# EAGLE design Lightning Breakout (EAGLE 7.2.0)
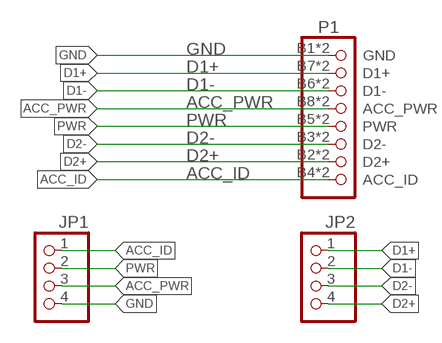
[diagram p0: schematic, sheet 1]

## Parts
JP1  PINHD-1X4  [1X04]
JP2  PINHD-1X4  [1X04]
P1  LIGHTNING-8PIN  [LIGHTNING]

## Nets
ACC_ID: JP1.1 P1.B4(ACC_ID) P1.T8(ACC_ID)
ACC_PWR: JP1.3 P1.B8(ACC_PWR) P1.T4(ACC_PWR)
D1+: JP2.1 P1.B7(D1+) P1.T2(D1+)
D1-: JP2.2 P1.B6(D1-) P1.T3(D1-)
D2+: JP2.4 P1.B2(D2+) P1.T7(D2+)
D2-: JP2.3 P1.B3(D2-) P1.T6(D2-)
GND: JP1.4 P1.B1(GND) P1.T1(GND)
PWR: JP1.2 P1.B5(PWR) P1.T5(PWR)

## Library data of the parts
JP1 JP2 = pinhead:PINHD-1X4: PIN HEADER
P1 = Apple_Lightning:LIGHTNING: PIN HEADER

## Board
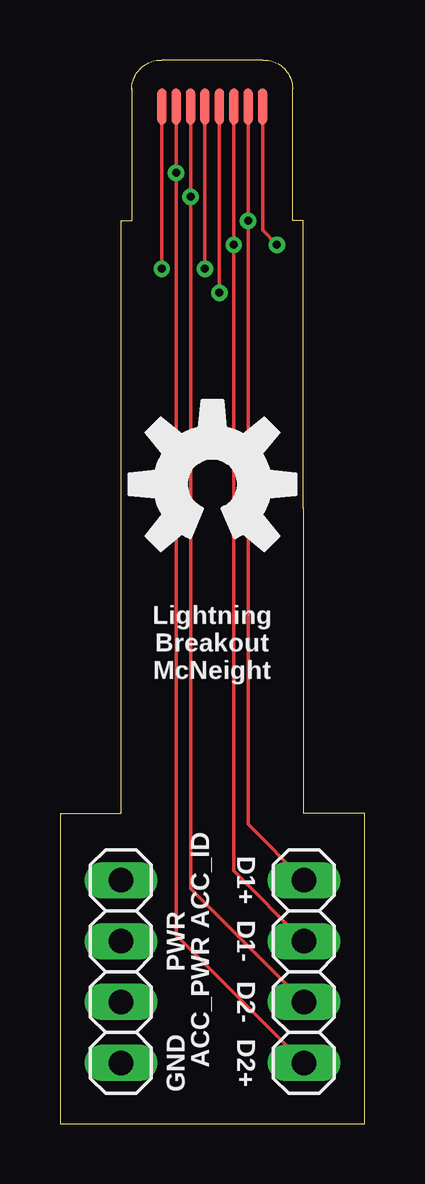
[diagram p1: board, top side]
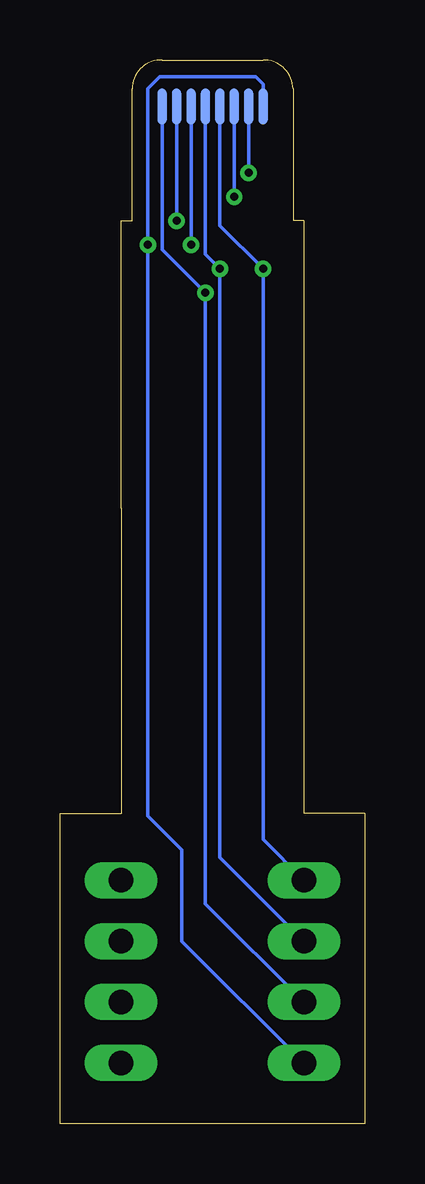
[diagram p2: board, bottom side, seen from below]

Size 12.7 x 44.35 mm. Coordinates in mm from the lower left corner, seen from the top.
Outline: 10.14,25.65 10.14,12.95 12.7,12.95 12.7,0 0,0 0,12.95 2.54,12.95 2.54,25.65
Copper layers (1*16): Top 0.0356mm / dielectric 1.5011mm / Bottom 0.0356mm
Design rules "oshpark-2layer": minimum track width 6mil, minimum drill 13mil, track to track 6mil, track to pad 6mil, pad to pad 6mil, via to via 6mil, smd to smd 6mil, copper to edge 15mil, drill to drill 6mil, minimum pad ring 7mil, minimum via ring 7mil, stop-mask expansion 4mil, vias tented up to drill 0mil, thermal gap 10mil

### Footprints (pad centres in the part's own frame; a part is rotated, then mirrored left to right if it is on the bottom)
1X04 = drill 1.016 long: 1 -3.81,0; 2 -1.27,0; 3 1.27,0; 4 3.81,0
LIGHTNING = smd 0.38 x 1.51 bottom: B1 -2.1,4.755; B2 -1.5,4.755; B3 -0.9,4.755; B4 -0.3,4.755; B5 0.3,4.755; B6 0.9,4.755; B7 1.5,4.755; B8 2.1,4.755 | smd 0.38 x 1.51: T1 2.1,4.755; T2 1.5,4.755; T3 0.9,4.755; T4 0.3,4.755; T5 -0.3,4.755; T6 -0.9,4.755; T7 -1.5,4.755; T8 -2.1,4.755

### Placement (x,y rotation side)
JP1  2.54,6.35 270 top
JP2  10.16,6.35 270 top
P1  6.34,37.65 0 top
U$1  [OSHW-LOGO-L]  6.35,26.67 0 top

### Tracks (layer width: path | path; a pad name or v marks a point on that pad's centre or on a via)
ACC_ID  (via drill 0.33 pad 0.41)
  Top 0.152: P1.T8 v4.24,35.65
  Bottom 0.152: P1.B4 6.04,37.45 v4.24,35.65 4.24,11.86 JP1.1
ACC_PWR  (via drill 0.33 pad 0.41)
  Top 0.152: P1.T4 v6.64,34.65
  Bottom 0.152: P1.B8 8.44,36.45 v6.64,34.65 6.64,9.18 JP1.3
D1+  (via drill 0.33 pad 0.41)
  Top 0.152: P1.T2 v7.84,37.65 7.84,12.48 JP2.1
  Bottom 0.152: v7.84,37.65 P1.T2
D1-  (via drill 0.33 pad 0.41)
  Top 0.152: P1.T3 v7.24,36.65 7.24,10.54 JP2.2
  Bottom 0.152: P1.T3 v7.24,36.65
D2+  (via drill 0.33 pad 0.41)
  Top 0.152: P1.T7 v4.84,39.65 4.84,7.86 JP2.4
  Bottom 0.152: P1.T7 v4.84,39.65
D2-  (via drill 0.33 pad 0.41)
  Top 0.152: P1.T6 v5.44,38.65 5.44,9.8 JP2.3
  Bottom 0.152: P1.T6 v5.44,38.65
GND  (via drill 0.33 pad 0.41)
  Top 0.152: P1.T1 8.44,37.25 v9.04,36.65
  Bottom 0.152: P1.B1 4.24,43.35 4.54,43.65 8.54,43.65 9.04,43.15 v9.04,36.65 9.04,12.85 7.62,11.43 7.62,7.62 JP1.4
PWR  (via drill 0.33 pad 0.41)
  Top 0.152: v6.04,35.65 P1.T5
  Bottom 0.152: P1.B5 6.64,36.25 v6.04,35.65 6.04,11.12 JP1.2

### Text on the board
tPlace: Lightning / Breakout / McNeight | ACC_ID | D1+ | PWR | D1- | ACC_PWR | D2- | GND | D2+